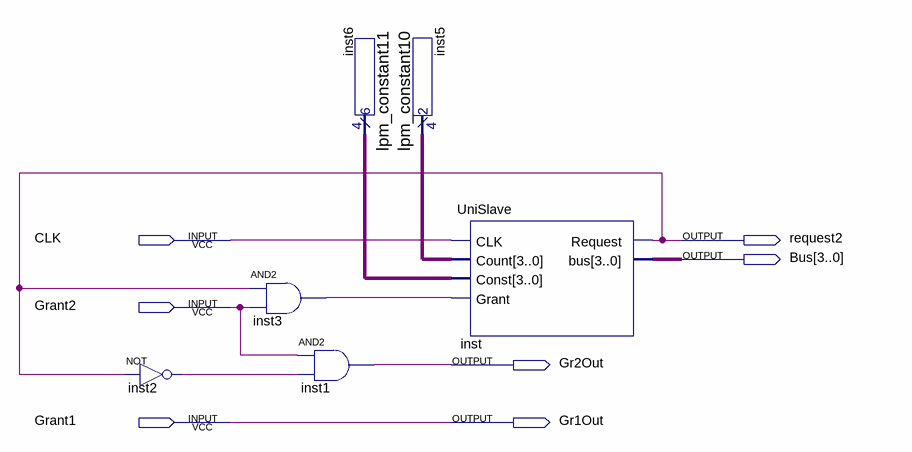
[diagram p0: schematic sheet]
// Quartus schematic Block6.bdf as structural Verilog: 6 symbols, 7 pins
module Block6 (
  input  CLK,
  input  Grant2,
  input  Grant1,
  output request2,
  output [3:0] Bus,
  output Gr2Out,
  output Gr1Out
);

  wire inst2_out, inst3_out;
  wire [3:0] inst5_result, inst6_result;

  not inst2 (inst2_out, request2);
  and inst3 (inst3_out, request2, Grant2);
  lpm_constant11 inst6 (.result(inst6_result));
  and inst1 (Gr2Out, Grant2, inst2_out);
  lpm_constant10 inst5 (.result(inst5_result));
  UniSlave inst (
    .CLK(CLK), .Count(inst5_result), .Const(inst6_result), .Grant(inst3_out), .Request(request2), .bus(Bus));

  assign Gr1Out = Grant1;
endmodule
